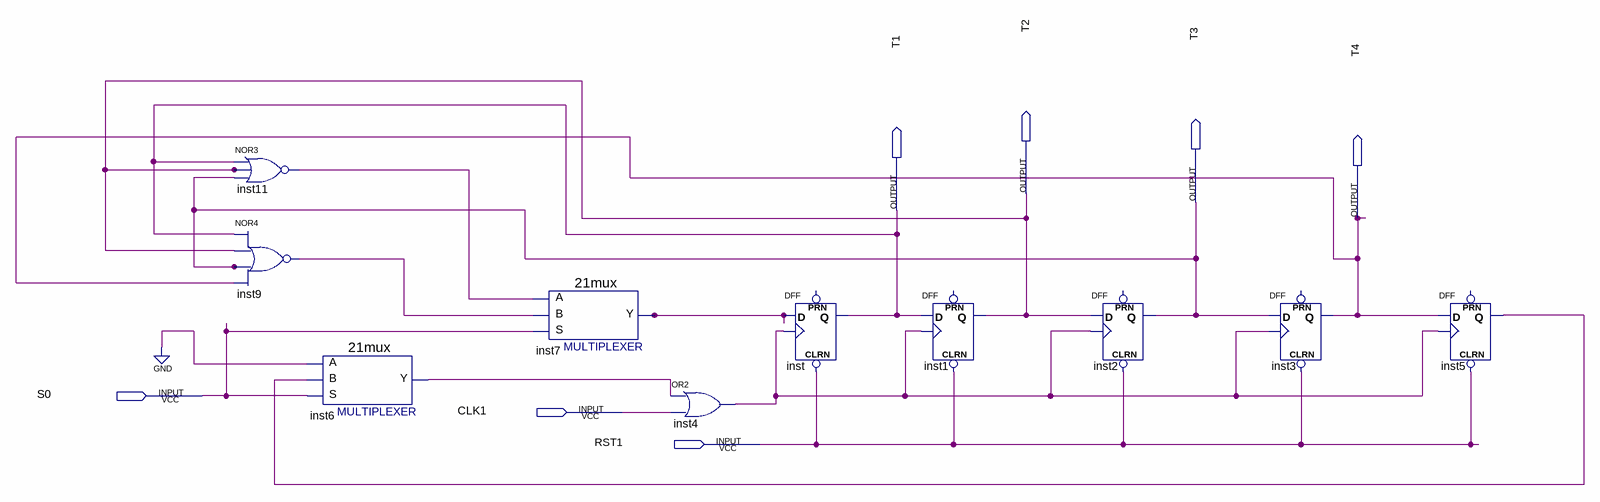
[diagram p0: schematic sheet]
// Quartus schematic exercise3.bdf as structural Verilog: 10 symbols, 7 pins
module exercise3 (
  input  S0,
  input  CLK1,
  input  RST1,
  output T2,
  output T3,
  output T1,
  output T4
);

  wire inst4_out, inst5_q, inst6_y, inst7_y, inst9_out, inst11_out;

  nor inst11 (inst11_out, T1, T2, T3);
  nor inst9 (inst9_out, T1, T2, T3, T4);
  \21mux  inst6 (.S(S0), .B(inst5_q), .A(1'b0), .Y(inst6_y));
  \21mux  inst7 (.S(S0), .B(inst9_out), .A(inst11_out), .Y(inst7_y));
  or inst4 (inst4_out, inst6_y, CLK1);
  DFF inst (.CLRN(RST1), .CLK(inst4_out), .D(inst7_y), .Q(T1));  // open: PRN
  DFF inst1 (.CLRN(RST1), .CLK(inst4_out), .D(T1), .Q(T2));  // open: PRN
  DFF inst2 (.CLRN(RST1), .CLK(inst4_out), .D(T2), .Q(T3));  // open: PRN
  DFF inst3 (.CLRN(RST1), .CLK(inst4_out), .D(T3), .Q(T4));  // open: PRN
  DFF inst5 (.CLRN(RST1), .CLK(inst4_out), .D(T4), .Q(inst5_q));  // open: PRN
endmodule
